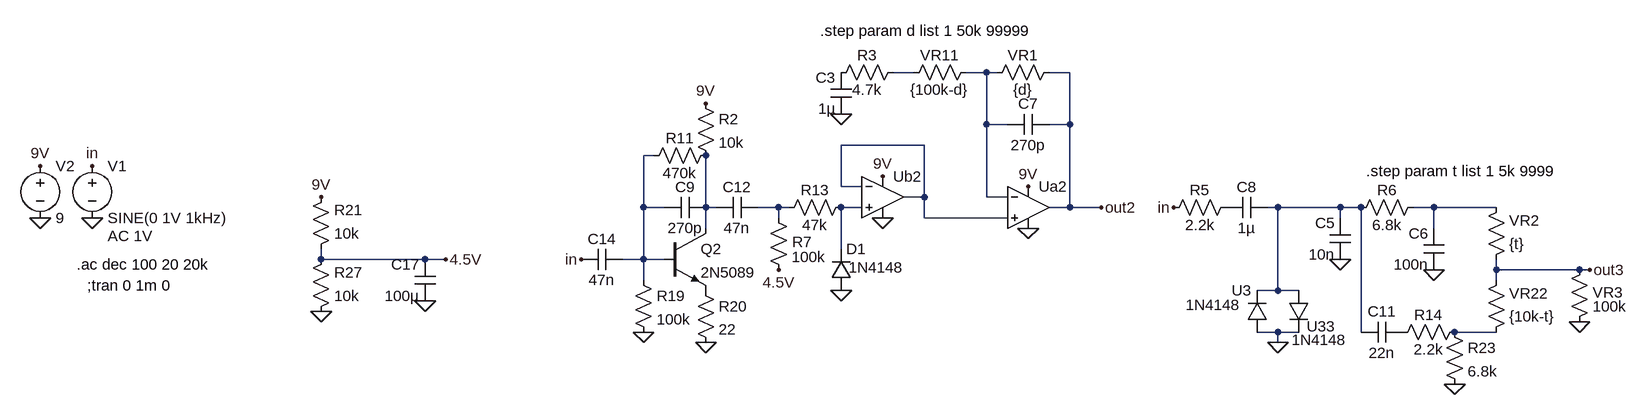
[diagram p0: schematic PrimeDistortion.asc]
PrimeDistortion.asc, the LTspice schematic file:
Version 4
SHEET 1 3148 2544
WIRE -352 1424 -384 1424
WIRE -240 1424 -272 1424
WIRE -224 1424 -240 1424
WIRE -112 1424 -144 1424
WIRE -240 1504 -240 1424
WIRE -208 1504 -240 1504
WIRE -112 1504 -112 1424
WIRE -112 1504 -144 1504
WIRE -336 1536 -464 1536
WIRE -752 1552 -768 1552
WIRE -464 1600 -464 1536
WIRE -432 1600 -464 1600
WIRE -336 1616 -336 1536
WIRE -336 1616 -368 1616
WIRE -240 1616 -240 1504
WIRE -208 1616 -240 1616
WIRE -768 1632 -768 1552
WIRE -736 1632 -768 1632
WIRE -672 1632 -672 1552
WIRE -656 1632 -672 1632
WIRE -560 1632 -592 1632
WIRE -544 1632 -560 1632
WIRE -432 1632 -464 1632
WIRE -112 1632 -112 1504
WIRE -112 1632 -144 1632
WIRE -64 1632 -112 1632
WIRE 208 1632 192 1632
WIRE 304 1632 208 1632
WIRE 336 1632 304 1632
WIRE 448 1632 416 1632
WIRE 544 1632 448 1632
WIRE -560 1648 -560 1632
WIRE -336 1648 -336 1616
WIRE -208 1648 -336 1648
WIRE 304 1648 304 1632
WIRE -672 1664 -672 1632
WIRE 448 1664 448 1632
WIRE -464 1696 -464 1632
WIRE -1264 1712 -1264 1696
WIRE -1104 1712 -1264 1712
WIRE -1072 1712 -1104 1712
WIRE -768 1712 -768 1632
WIRE -768 1712 -800 1712
WIRE -736 1712 -768 1712
WIRE 544 1728 544 1712
WIRE 672 1728 544 1728
WIRE 688 1728 672 1728
WIRE -768 1744 -768 1712
WIRE 544 1744 544 1728
WIRE 208 1760 208 1632
WIRE 208 1760 176 1760
WIRE 240 1760 208 1760
WIRE 208 1824 176 1824
WIRE 240 1824 208 1824
WIRE 336 1824 336 1632
WIRE 544 1824 480 1824
WIRE 208 1840 208 1824
FLAG -1616 1648 0
FLAG -1616 1568 in
FLAG -1264 1792 0
FLAG -1104 1776 0
FLAG -1072 1712 4.5V
FLAG -1696 1648 0
FLAG -1696 1568 9V
FLAG -1264 1616 9V
FLAG -768 1824 0
FLAG -672 1840 0
FLAG -672 1472 9V
FLAG -560 1728 4.5V
FLAG -400 1648 0
FLAG -464 1760 0
FLAG -400 1584 9V
FLAG -176 1600 9V
FLAG -176 1664 0
FLAG -464 1488 0
FLAG -64 1632 out2
FLAG 688 1728 out3
FLAG 48 1632 in
FLAG -864 1712 in
FLAG 304 1712 0
FLAG 448 1728 0
FLAG 672 1808 0
FLAG 480 1904 0
FLAG 208 1840 0
SYMBOL voltage -1616 1552 R0
WINDOW 123 24 124 Left 2
WINDOW 39 0 0 Left 2
SYMATTR Value2 AC 1V
SYMATTR InstName V1
SYMATTR Value SINE(0 1V 1kHz)
SYMBOL res -256 1408 R90
WINDOW 0 5 56 VBottom 2
WINDOW 3 27 56 VTop 2
SYMATTR InstName VR11
SYMATTR Value {100k-d}
SYMBOL res -128 1408 R90
WINDOW 0 5 56 VBottom 2
WINDOW 3 27 56 VTop 2
SYMATTR InstName VR1
SYMATTR Value {d}
SYMBOL res -1280 1712 M180
WINDOW 0 36 76 Left 2
WINDOW 3 36 40 Left 2
SYMATTR InstName R21
SYMATTR Value 10k
SYMBOL res -1280 1808 M180
WINDOW 0 36 76 Left 2
WINDOW 3 36 40 Left 2
SYMATTR InstName R27
SYMATTR Value 10k
SYMBOL cap -1088 1776 R180
WINDOW 0 24 56 Left 2
WINDOW 3 24 8 Left 2
SYMATTR InstName C17
SYMATTR Value 100µ
SYMBOL voltage -1696 1552 R0
WINDOW 123 0 0 Left 0
WINDOW 39 0 0 Left 0
SYMATTR InstName V2
SYMATTR Value 9
SYMBOL cap -800 1696 R90
WINDOW 0 0 32 VBottom 2
WINDOW 3 32 32 VTop 2
SYMATTR InstName C14
SYMATTR Value 47n
SYMBOL res -784 1728 R0
SYMATTR InstName R19
SYMATTR Value 100k
SYMBOL npn -736 1664 R0
SYMATTR InstName Q2
SYMATTR Value 2N5089
SYMBOL res -688 1744 R0
SYMATTR InstName R20
SYMATTR Value 22
SYMBOL res -656 1536 R90
WINDOW 0 5 56 VBottom 2
WINDOW 3 27 56 VTop 2
SYMATTR InstName R11
SYMATTR Value 470k
SYMBOL cap -672 1616 R90
WINDOW 0 0 32 VBottom 2
WINDOW 3 32 32 VTop 2
SYMATTR InstName C9
SYMATTR Value 270p
SYMBOL res -688 1456 R0
SYMATTR InstName R2
SYMATTR Value 10k
SYMBOL cap -592 1616 R90
WINDOW 0 0 32 VBottom 2
WINDOW 3 32 32 VTop 2
SYMATTR InstName C12
SYMATTR Value 47n
SYMBOL res -576 1632 R0
WINDOW 0 37 53 Left 2
SYMATTR InstName R7
SYMATTR Value 100k
SYMBOL Opamps\\UniversalOpamp2 -400 1616 R0
SYMATTR InstName Ub2
SYMBOL res -448 1616 R90
WINDOW 0 5 56 VBottom 2
WINDOW 3 27 56 VTop 2
SYMATTR InstName R13
SYMATTR Value 47k
SYMBOL diode -480 1760 M180
WINDOW 0 24 64 Left 2
WINDOW 3 28 36 Left 2
SYMATTR InstName D1
SYMATTR Value 1N4148
SYMBOL Opamps\\UniversalOpamp2 -176 1632 R0
SYMATTR InstName Ua2
SYMBOL cap -144 1488 R90
WINDOW 0 0 32 VBottom 2
WINDOW 3 32 32 VTop 2
SYMATTR InstName C7
SYMATTR Value 270p
SYMBOL res -368 1408 R90
WINDOW 0 5 56 VBottom 2
WINDOW 3 27 56 VTop 2
SYMATTR InstName R3
SYMATTR Value 4.7k
SYMBOL cap -448 1488 R180
WINDOW 0 24 56 Left 2
WINDOW 3 24 8 Left 2
SYMATTR InstName C3
SYMATTR Value 1µ
SYMBOL res 144 1616 R90
WINDOW 0 5 56 VBottom 2
WINDOW 3 27 56 VTop 2
SYMATTR InstName R5
SYMATTR Value 2.2k
SYMBOL cap 192 1616 R90
WINDOW 0 0 32 VBottom 2
WINDOW 3 32 32 VTop 2
SYMATTR InstName C8
SYMATTR Value 1µ
SYMBOL diode 192 1824 R180
WINDOW 0 24 64 Left 2
WINDOW 3 41 42 Left 2
SYMATTR InstName U3
SYMATTR Value 1N4148
SYMBOL diode 224 1760 R0
WINDOW 0 28 55 Left 2
WINDOW 3 5 76 Left 2
SYMATTR InstName U33
SYMATTR Value 1N4148
SYMBOL cap 320 1712 R180
WINDOW 0 24 56 Left 2
WINDOW 3 24 8 Left 2
SYMATTR InstName C5
SYMATTR Value 10n
SYMBOL res 432 1616 R90
WINDOW 0 5 56 VBottom 2
WINDOW 3 27 56 VTop 2
SYMATTR InstName R6
SYMATTR Value 6.8k
SYMBOL cap 464 1728 R180
WINDOW 0 24 56 Left 2
WINDOW 3 24 8 Left 2
SYMATTR InstName C6
SYMATTR Value 100n
SYMBOL cap 400 1808 R90
WINDOW 0 0 32 VBottom 2
WINDOW 3 32 32 VTop 2
SYMATTR InstName C11
SYMATTR Value 22n
SYMBOL res 496 1808 R90
WINDOW 0 5 56 VBottom 2
WINDOW 3 27 56 VTop 2
SYMATTR InstName R14
SYMATTR Value 2.2k
SYMBOL res 464 1808 R0
SYMATTR InstName R23
SYMATTR Value 6.8k
SYMBOL res 528 1728 M180
WINDOW 0 36 76 Left 2
WINDOW 3 36 40 Left 2
SYMATTR InstName VR2
SYMATTR Value {t}
SYMBOL res 528 1840 M180
WINDOW 0 36 76 Left 2
WINDOW 3 36 40 Left 2
SYMATTR InstName VR22
SYMATTR Value {10k-t}
SYMBOL res 656 1824 M180
WINDOW 0 36 61 Left 2
WINDOW 3 36 40 Left 2
SYMATTR InstName VR3
SYMATTR Value 100k
TEXT -1640 1720 Left 2 !.ac dec 100 20 20k
TEXT -1624 1752 Left 2 !;tran 0 1m 0
TEXT -496 1360 Left 2 !.step param d list 1 50k 99999
TEXT 344 1576 Left 2 !.step param t list 1 5k 9999

The netlist it stands for:
* PrimeDistortion.asc
V1 in 0 SINE(0 1V 1kHz) AC 1V
R§VR11 N002 N001 {100k-d}
R§VR1 out2 N002 {d}
R21 4.5V 9V 10k
R27 0 4.5V 10k
C17 0 4.5V 100µ
V2 9V 0 9
C14 N004 in 47n
R19 N004 0 100k
Q2 N005 N004 P001 0 2N5089
R20 P001 0 22
R11 N005 N004 470k
C9 N005 N004 270p
R2 9V N005 10k
C12 N006 N005 47n
R7 N006 4.5V 100k
XUb2 N007 N003 9V 0 N003 level.2 Avol=1Meg GBW=10Meg Slew=10Meg ilimit=25m rail=0 Vos=0 phimargin=45 en=0 enk=0 in=0 ink=0 Rin=500Meg  ; pins IN+ IN- V+ V- OUT
R13 N007 N006 47k
D1 0 N007 1N4148
XUa2 N003 N002 9V 0 out2 level.2 Avol=1Meg GBW=10Meg Slew=10Meg ilimit=25m rail=0 Vos=0 phimargin=45 en=0 enk=0 in=0 ink=0 Rin=500Meg  ; pins IN+ IN- V+ V- OUT
C7 out2 N002 270p
R3 N001 P002 4.7k
C3 0 P002 1µ
R5 P003 in 2.2k
C8 N008 P003 1µ
D§U3 0 N008 1N4148
D§U33 N008 0 1N4148
C5 0 N008 10n
R6 N009 N008 6.8k
C6 0 N009 100n
C11 P004 N008 22n
R14 N010 P004 2.2k
R23 N010 0 6.8k
R§VR2 out3 N009 {t}
R§VR22 N010 out3 {10k-t}
R§VR3 0 out3 100k
.model D D
.lib standard.dio
.model NPN NPN
.model PNP PNP
.lib standard.bjt
.ac dec 100 20 20k
;tran 0 1m 0
.step param d list 1 50k 99999
.step param t list 1 5k 9999
.lib UniversalOpamps2.sub
.backanno
.end